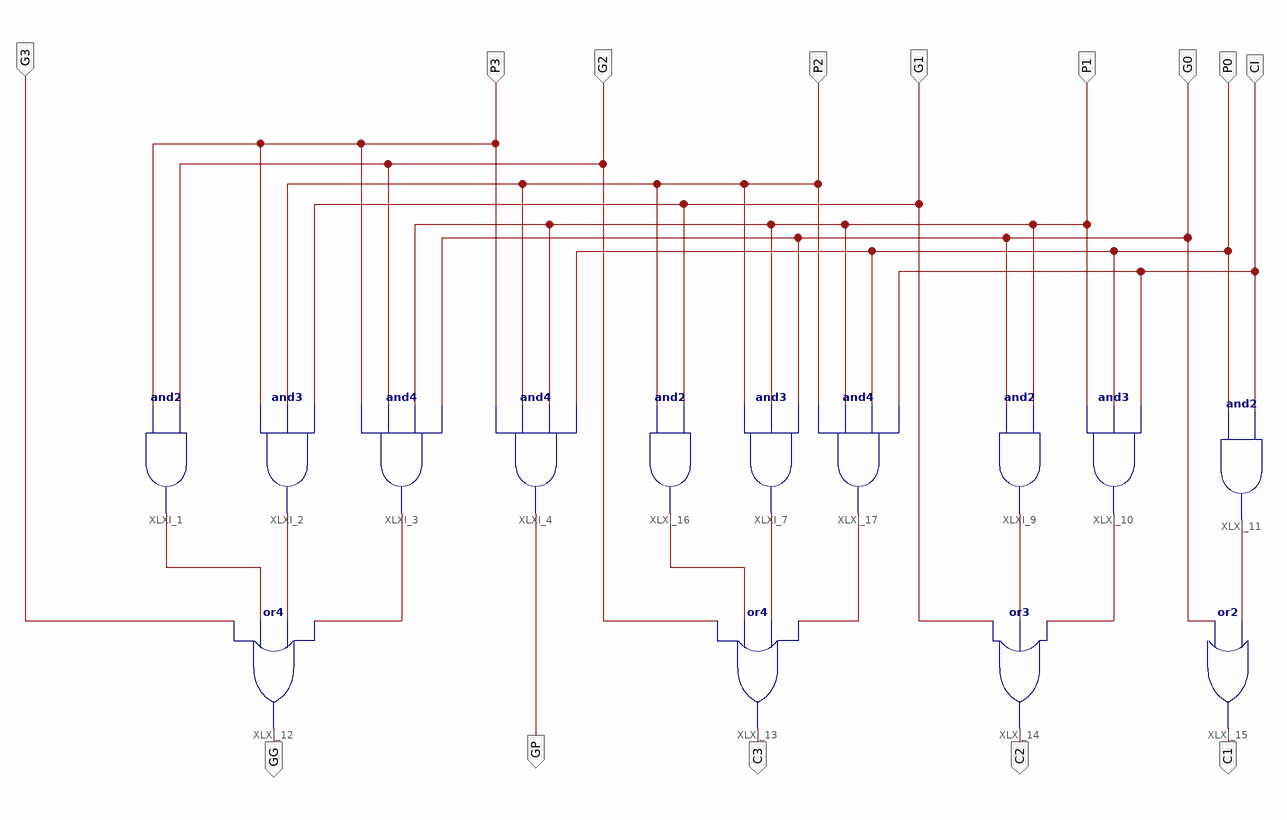
[diagram p0: schematic sheet 1]
// Xilinx ISE schematic CLA.sch (kintex7) as structural Verilog: 14 symbols, 14 ports
module CLA (
  input  G3,
  input  G2,
  input  G1,
  input  G0,
  input  P3,
  input  P2,
  input  P1,
  input  CI,
  input  P0,
  output GP,
  output C1,
  output C2,
  output C3,
  output GG
);

  wire XLXN_2, XLXN_3, XLXN_4, XLXN_7, XLXN_15, XLXN_16, XLXN_18, XLXN_19, XLXN_20;

  and XLXI_1 (XLXN_2, P3, G2);
  and XLXI_2 (XLXN_3, P3, P2, G1);
  and XLXI_3 (XLXN_4, P3, G2, P1, G0);
  and XLXI_4 (GP, P3, P2, P1, P0);
  and XLXI_7 (XLXN_15, P2, P1, G0);
  and XLXI_9 (XLXN_18, G0, P1);
  and XLXI_10 (XLXN_19, P1, P0, CI);
  and XLXI_11 (XLXN_20, P0, CI);
  or XLXI_12 (GG, G3, XLXN_2, XLXN_3, XLXN_4);
  or XLXI_13 (C3, G2, XLXN_7, XLXN_15, XLXN_16);
  or XLXI_14 (C2, G1, XLXN_18, XLXN_19);
  or XLXI_15 (C1, G0, XLXN_20);
  and XLXI_16 (XLXN_7, P2, G1);
  and XLXI_17 (XLXN_16, P2, P1, P0, CI);
endmodule
